# EAGLE design PlacaSchematic (EAGLE 5.11)
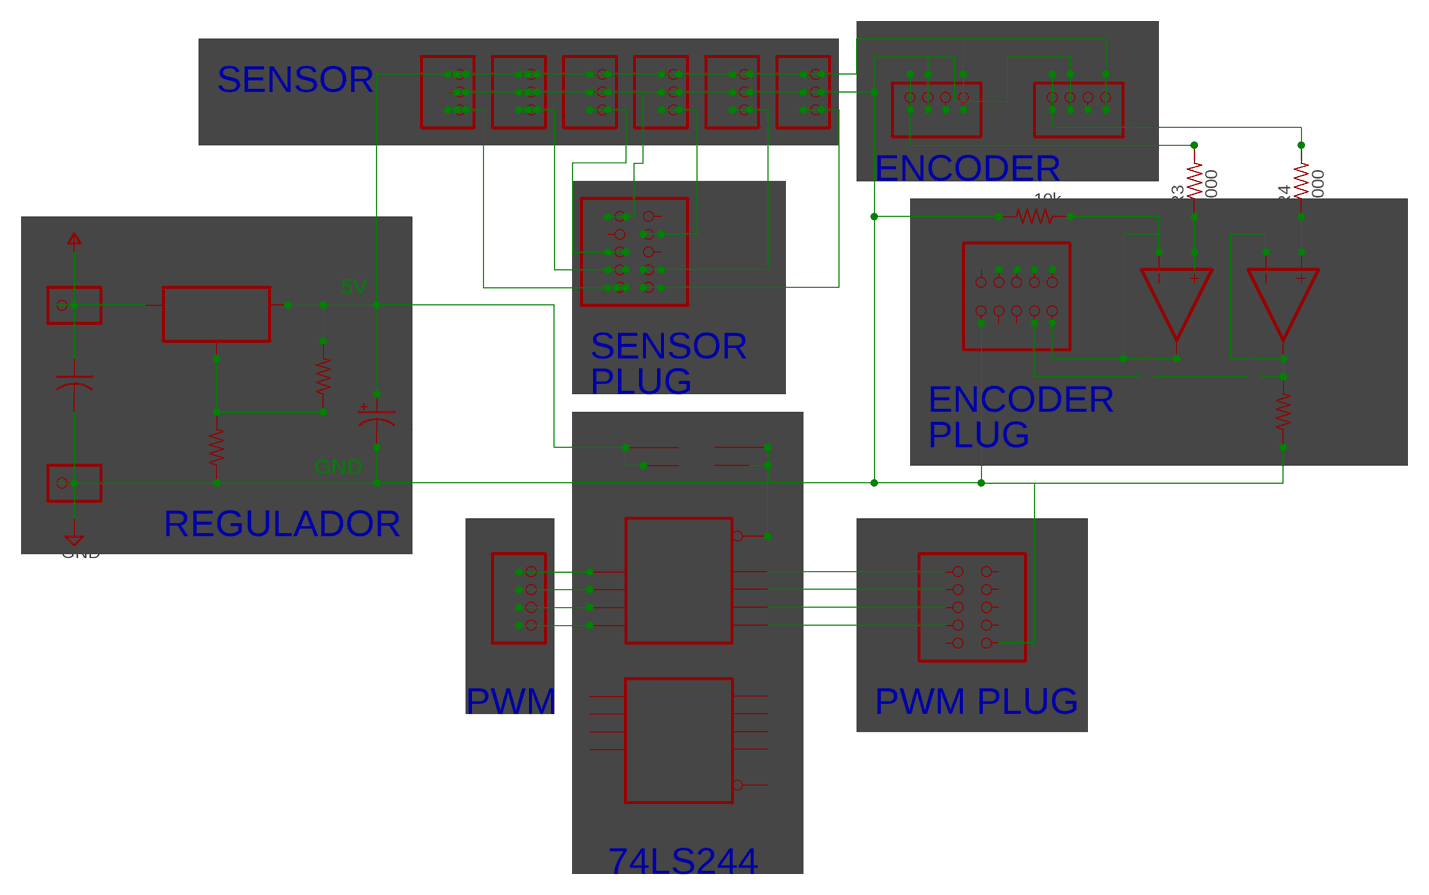
[diagram p0: schematic, sheet 1]

## Parts
C1  1K63  C-US050-025X075  [C050-025X075]
C2  1uF  CPOL-USE2-5  [E2-5]
IC1  317T  [TO220H]
IC2  74LS244N  [DIL20]
IC3  LM324N  [DIL14]
JP1  S1  PINHD-1X3  [1X03]
JP2  S2  PINHD-1X3  [1X03]
JP3  S3  PINHD-1X3  [1X03]
JP4  S4  PINHD-1X3  [1X03]
JP5  S5  PINHD-1X3  [1X03]
JP6  S6  PINHD-1X3  [1X03]
JP7  ENC1  PINHD-1X4  [1X04]
JP8  ENC2  PINHD-1X4  [1X04]
JP9  PWM  PINHD-1X4  [1X04]
JP10  PINHD-1X1  [1X01]
JP11  PINHD-1X1  [1X01]
JP16  SENSOR  PINHD-2X5  [2X05]
JP17  ENCODER  PINHD-2X5  [2X05]
JP18  PWM  PINHD-2X5  [2X05]
R1  330  R-US_0207/10  [0207/10]
R2  1000  R-US_0207/10  [0207/10]
R3  1000  R-US_0207/10  [0207/10]
R4  1000  R-US_0207/10  [0207/10]
R5  10k  R-US_0207/10  [0207/10]
R6  10k  R-US_0207/10  [0207/10]

## Nets
GND: C1.2 C2.- IC2.1(A:G) IC2.10(P:GND) IC3.11(P:V-) JP1.2 JP2.2 JP3.2 JP4.2 JP5.2 JP6.2 JP7.2 JP8.2 JP11.1 JP16.10 JP17.10 JP18.1 R2.1 R5.2 R6.1
N$1: IC1.1(ADJ) R1.1 R2.2
N$2: C2.+ IC1.2(VO) IC2.20(P:VCC) IC3.4(P:V+) JP1.1 JP2.1 JP3.1 JP4.1 JP5.1 JP6.1 JP7.4 JP8.4 R1.2
N$3: IC3.13(D:-IN) IC3.14(D:OUT) JP17.4 R6.2
N$4: IC2.12(A:Y4) JP9.1
N$5: IC2.14(A:Y3) JP9.2
N$6: IC2.16(A:Y2) JP9.3
N$7: IC2.18(A:Y1) JP9.4
N$8: IC2.2(A:A1) JP18.4
N$9: IC2.4(A:A2) JP18.6
N$10: IC2.6(A:A3) JP18.8
N$11: IC2.8(A:A4) JP18.10
N$12: JP8.3
N$13: JP7.1 R3.2
N$14: JP17.7
N$15: JP1.3 JP16.2
N$16: JP2.3 JP16.4
N$17: JP3.3 JP16.6
N$18: JP4.3 JP16.7
N$19: JP5.3 JP16.3
N$20: JP6.3 JP16.1
N$21: JP7.3
N$22: JP17.5
N$23: JP17.3
N$24: JP17.1
N$26: IC3.8(C:OUT) IC3.9(C:-IN) JP17.2 R5.1
N$27: IC3.10(C:+IN) R3.1
N$28: IC3.12(D:+IN) R4.1
N$29: JP8.1 R4.2
V+: C1.1 IC1.3(VI) JP10.1
Unconnected: IC2.3(B:Y4) IC2.5(B:Y3) IC2.7(B:Y2) IC2.9(B:Y1) IC2.11(B:A1) IC2.13(B:A2) IC2.15(B:A3) IC2.17(B:A4) IC2.19(B:G) IC3.1(A:OUT) IC3.2(A:-IN) IC3.3(A:+IN) IC3.5(B:+IN) IC3.6(B:-IN) IC3.7(B:OUT) JP16.5 JP16.8 JP16.9 JP17.6 JP17.8 JP17.9 JP18.2 JP18.3 JP18.5 JP18.7 JP18.9

## Notes on the sheet
- SENSOR
- ENCODER
- 5V
- SENSOR
- PLUG
- ENCODER
- PLUG
- GND
- REGULADOR
- PWM | PWM PLUG
- 74LS244

## Library data of the parts
C1 = rcl:C-US: CAPACITOR, American symbol
C2 = rcl:CPOL-US: POLARIZED CAPACITOR, American symbol
IC1 = linear:*317: Positive VOLTAGE REGULATOR
IC2 = 74xx-us:74*244: Octal BUFFER and LINE DRIVER, 3-state
IC3 = linear:LM324: OP AMP
JP1-JP6 = pinhead:PINHD-1X3: PIN HEADER
JP7-JP9 = pinhead:PINHD-1X4: PIN HEADER
JP10 JP11 = pinhead:PINHD-1X1: PIN HEADER
JP16-JP18 = pinhead:PINHD-2X5: PIN HEADER
R1-R6 = resistor:R-US_: RESISTOR, American symbol

## Board
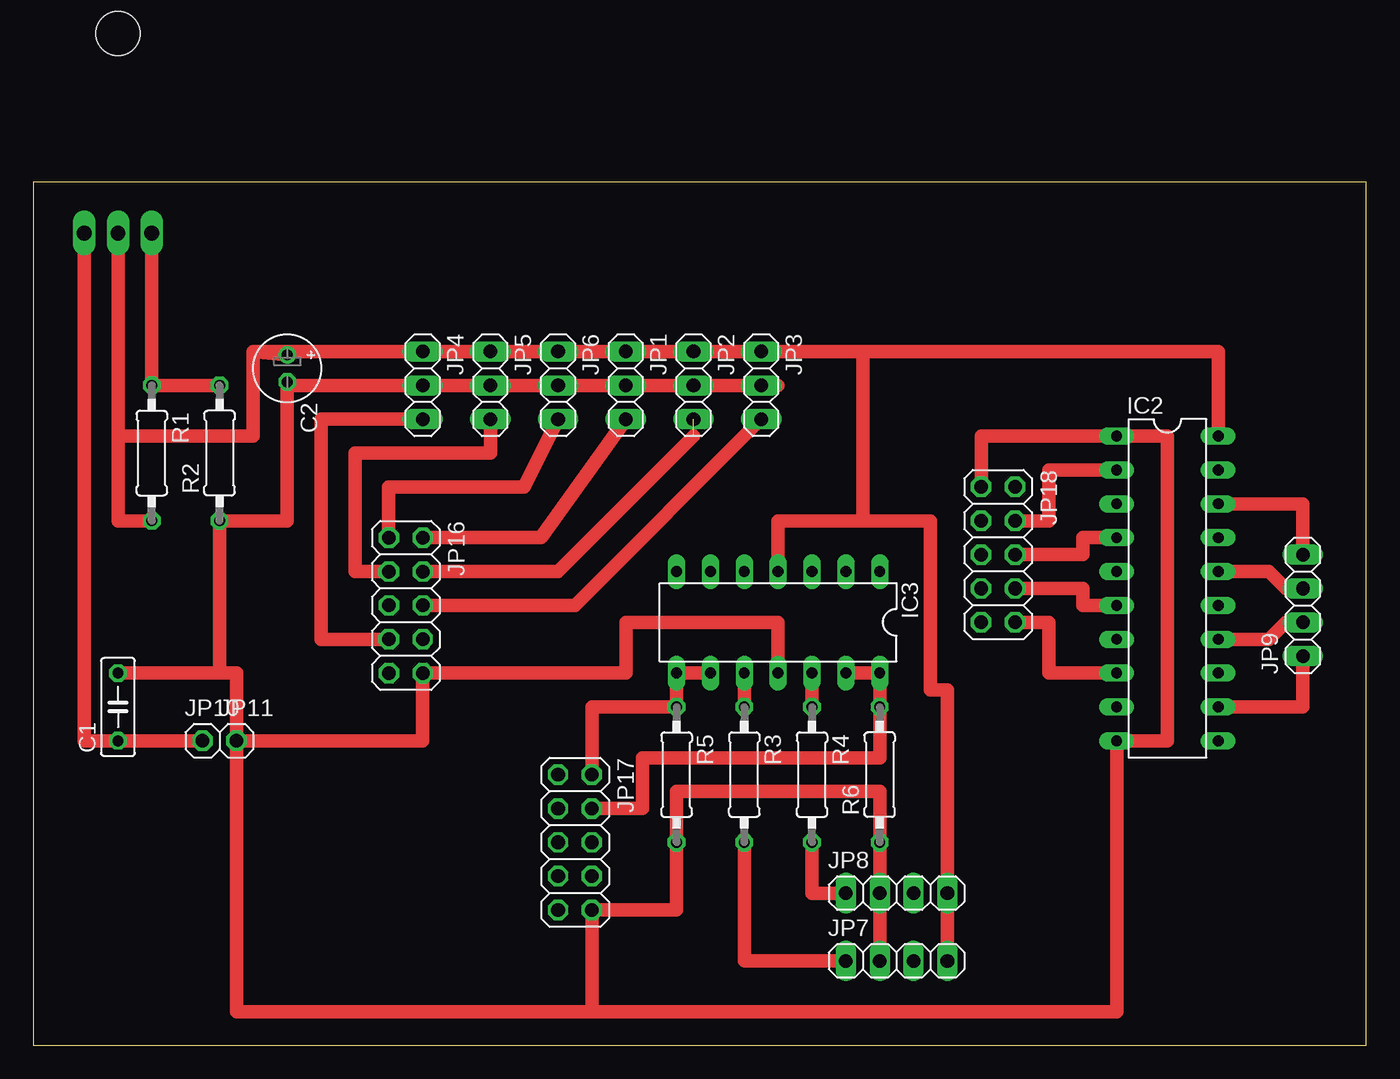
[diagram p1: board, top side]
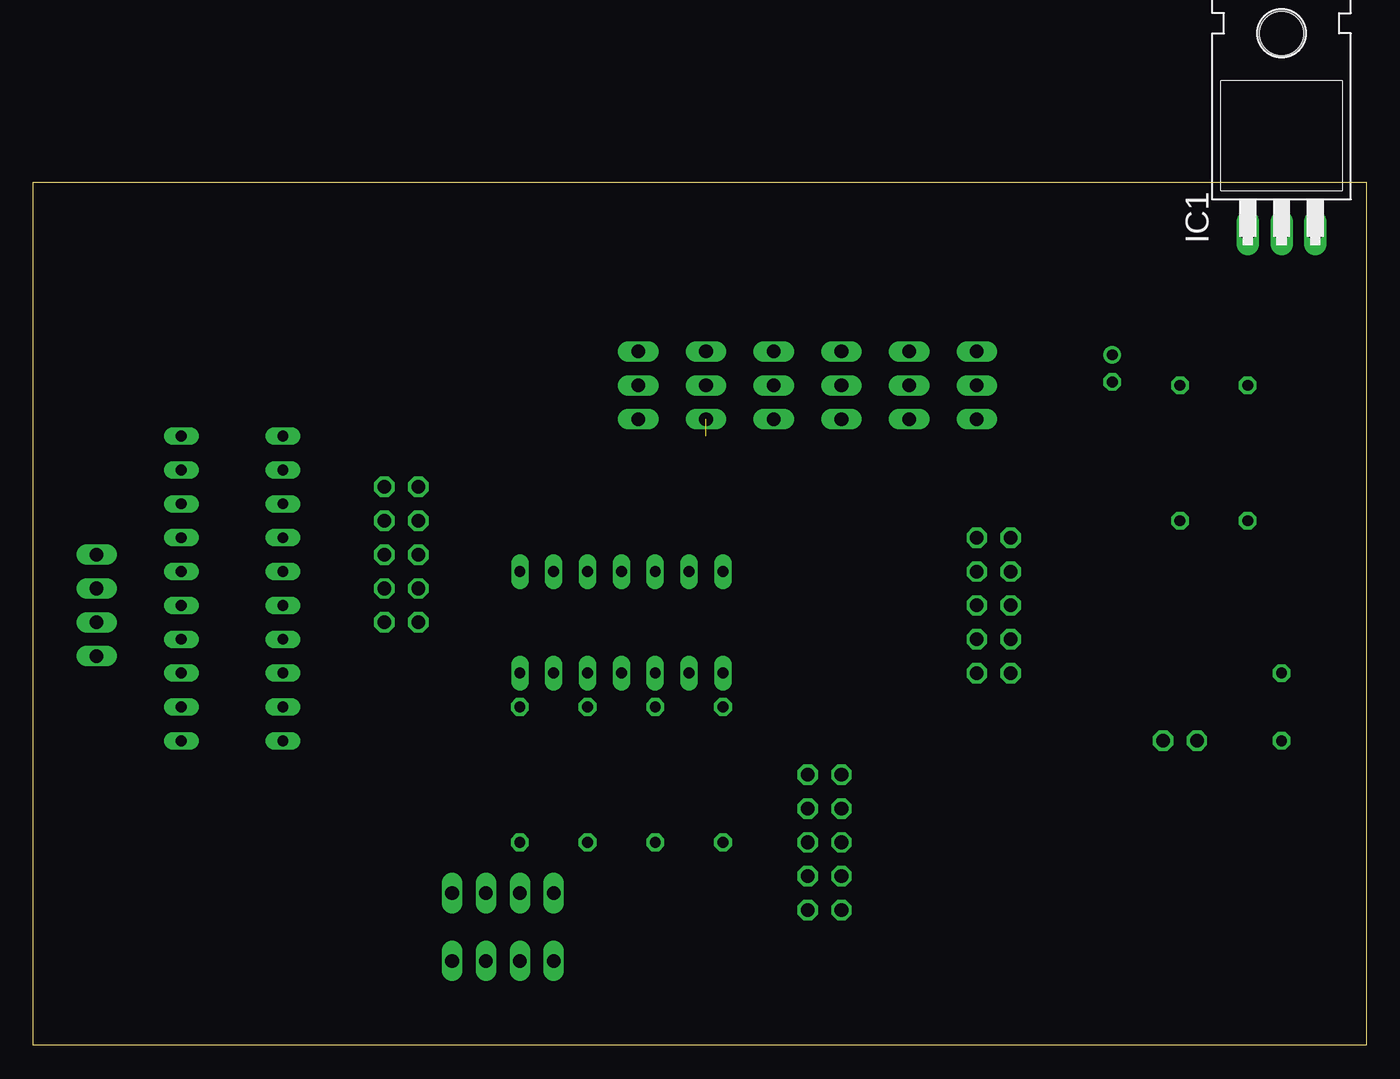
[diagram p2: board, bottom side, seen from below]

Size 100 x 64.76 mm. Coordinates in mm from the lower left corner, seen from the top.
Outline: 0,0 100,0 100,64.76 0,64.76 0,0
Copper layers (1*16): Top 0.035mm / dielectric 1.5mm / Bottom 0.035mm
Design rules "default *": minimum track width 30mil, minimum drill 24mil, track to track 8mil, track to pad 8mil, pad to pad 8mil, via to via 8mil, smd to smd 8mil, copper to edge 40mil, drill to drill 8mil, minimum pad ring 10mil, minimum via ring 8mil, stop-mask expansion 4mil, vias tented up to drill 0mil, thermal gap 10mil

### Footprints (pad centres in the part's own frame; a part is rotated, then mirrored left to right if it is on the bottom)
C050-025X075 = drill 0.813 octagon: 1 -2.54,0; 2 2.54,0
E2-5 = drill 0.813 pad 1.27 round: + -1.016,0 | drill 0.813 pad 1.27 octagon: - 1.016,0
TO220H = drill 1.118 long: 1 -2.54,-10.16; 2 0,-10.16; 3 2.54,-10.16 | hole 3.302: 0,4.826
DIL20 = drill 0.813 long: 1 -11.43,-3.81; 2 -8.89,-3.81; 3 -6.35,-3.81; 4 -3.81,-3.81; 5 -1.27,-3.81; 6 1.27,-3.81; 7 3.81,-3.81; 8 6.35,-3.81; 9 8.89,-3.81; 10 11.43,-3.81; 11 11.43,3.81; 12 8.89,3.81; 13 6.35,3.81; 14 3.81,3.81; 15 1.27,3.81; 16 -1.27,3.81; 17 -3.81,3.81; 18 -6.35,3.81; 19 -8.89,3.81; 20 -11.43,3.81
DIL14 = drill 0.813 long: 1 -7.62,-3.81; 2 -5.08,-3.81; 3 -2.54,-3.81; 4 0,-3.81; 5 2.54,-3.81; 6 5.08,-3.81; 7 7.62,-3.81; 8 7.62,3.81; 9 5.08,3.81; 10 2.54,3.81; 11 0,3.81; 12 -2.54,3.81; 13 -5.08,3.81; 14 -7.62,3.81
1X03 = drill 1.016 long: 1 -2.54,0; 2 0,0; 3 2.54,0
1X04 = drill 1.016 long: 1 -3.81,0; 2 -1.27,0; 3 1.27,0; 4 3.81,0
1X01 = drill 1.016 octagon: 1 0,0
2X05 = drill 1.016 octagon: 1 -5.08,-1.27; 2 -5.08,1.27; 3 -2.54,-1.27; 4 -2.54,1.27; 5 0,-1.27; 6 0,1.27; 7 2.54,-1.27; 8 2.54,1.27; 9 5.08,-1.27; 10 5.08,1.27
0207/10 = drill 0.813 octagon: 1 -5.08,0; 2 5.08,0

### Placement (x,y rotation side)
C1  6.35,25.4 90 top
C2  19.05,50.8 270 top
IC1  6.35,71.12 0 bottom
IC2  85.09,34.29 270 top
IC3  55.88,31.75 180 top
JP1  44.45,49.53 270 top
JP2  49.53,49.53 270 top
JP3  54.61,49.53 270 top
JP4  29.21,49.53 270 top
JP5  34.29,49.53 270 top
JP6  39.37,49.53 270 top
JP7  64.77,6.35 0 top
JP8  64.77,11.43 0 top
JP9  95.25,33.02 90 top
JP10  12.7,22.86 0 top
JP11  15.24,22.86 0 top
JP16  27.94,33.02 270 top
JP17  40.64,15.24 270 top
JP18  72.39,36.83 270 top
R1  8.89,44.45 270 top
R2  13.97,44.45 90 top
R3  53.34,20.32 270 top
R4  58.42,20.32 270 top
R5  48.26,20.32 270 top
R6  63.5,20.32 90 top

### Tracks (layer width: path | path; a pad name or v marks a point on that pad's centre or on a via)
GND
  Top 1: IC2.10 85.09,22.86 85.09,45.72 IC2.1 71.12,45.72 JP18.1 | 13.97,27.94 15.24,27.94 JP11.1 | 13.97,27.94 C1.2 | 13.97,27.94 R2.1 19.05,39.37 19.05,49.53 | 19.05,49.53 JP4.2 JP5.2 JP6.2 JP1.2 JP2.2 JP3.2 55.88,49.53 | 19.05,49.53 C2.- | JP11.1 15.24,2.54 41.91,2.54 | 41.91,2.54 81.28,2.54 IC2.10 | IC2.10 81.28,13.97 | IC3.11 55.88,31.75 44.45,31.75 44.45,27.94 JP16.10 29.21,22.86 JP11.1 | JP7.2 JP8.2 R6.1 63.5,19.05 48.26,19.05 R5.2 48.26,10.16 JP17.10 41.91,2.54
N$1
  Top 1: R2.2 R1.1 IC1.1
N$2
  Top 1: IC2.20 88.9,52.07 62.23,52.07 | R1.2 6.35,39.37 6.35,45.72 | 6.35,45.72 IC1.2 | 16.51,52.07 JP4.1 JP5.1 JP6.1 JP1.1 JP2.1 JP3.1 62.23,52.07 | 6.35,45.72 16.51,45.72 16.51,52.07 | 16.51,52.07 C2.+ | IC3.4 55.88,39.37 62.23,39.37 | 62.23,39.37 67.31,39.37 67.31,26.67 68.58,26.67 JP8.4 JP7.4 | 62.23,52.07 62.23,39.37
N$3
  Top 1: IC3.13 IC3.14 R6.2 63.5,21.59 45.72,21.59 45.72,17.78 JP17.4
N$4
  Top 1: IC2.12 95.25,25.4 JP9.1
N$5
  Top 1: IC2.14 92.71,30.48 93.98,31.75 JP9.2
N$6
  Top 1: IC2.16 92.71,35.56 93.98,34.29 JP9.3
N$7
  Top 1: IC2.18 95.25,40.64 JP9.4
N$8
  Top 1: JP18.4 76.2,39.37 76.2,43.18 IC2.2
N$9
  Top 1: JP18.6 78.74,36.83 78.74,38.1 IC2.4
N$10
  Top 1: JP18.8 78.74,34.29 78.74,33.02 IC2.6
N$11
  Top 1: JP18.10 76.2,31.75 76.2,27.94 IC2.8
N$13
  Top 1: JP7.1 53.34,6.35 R3.2
N$15
  Top 1: JP1.3 38.1,38.1 JP16.2
N$16  (1 unrouted)
  Top 1: JP16.4 39.37,35.56 49.53,45.72
N$17
  Top 1: JP16.6 40.64,33.02 JP3.3
N$18
  Top 1: JP4.3 21.59,46.99 21.59,30.48 JP16.7
N$19
  Top 1: JP5.3 34.29,44.45 24.13,44.45 24.13,35.56 JP16.3
N$20
  Top 1: JP6.3 36.83,41.91 26.67,41.91 JP16.1
N$26
  Top 1: JP17.2 41.91,25.4 R5.1 IC3.8 IC3.9
N$27
  Top 1: R3.1 IC3.10
N$28
  Top 1: R4.1 IC3.12
N$29
  Top 1: JP8.1 58.42,11.43 R4.2
V+
  Top 1: JP10.1 C1.1 3.81,22.86 IC1.3